# EAGLE design DIP-VGA-v1.0 (EAGLE 7.5.0)
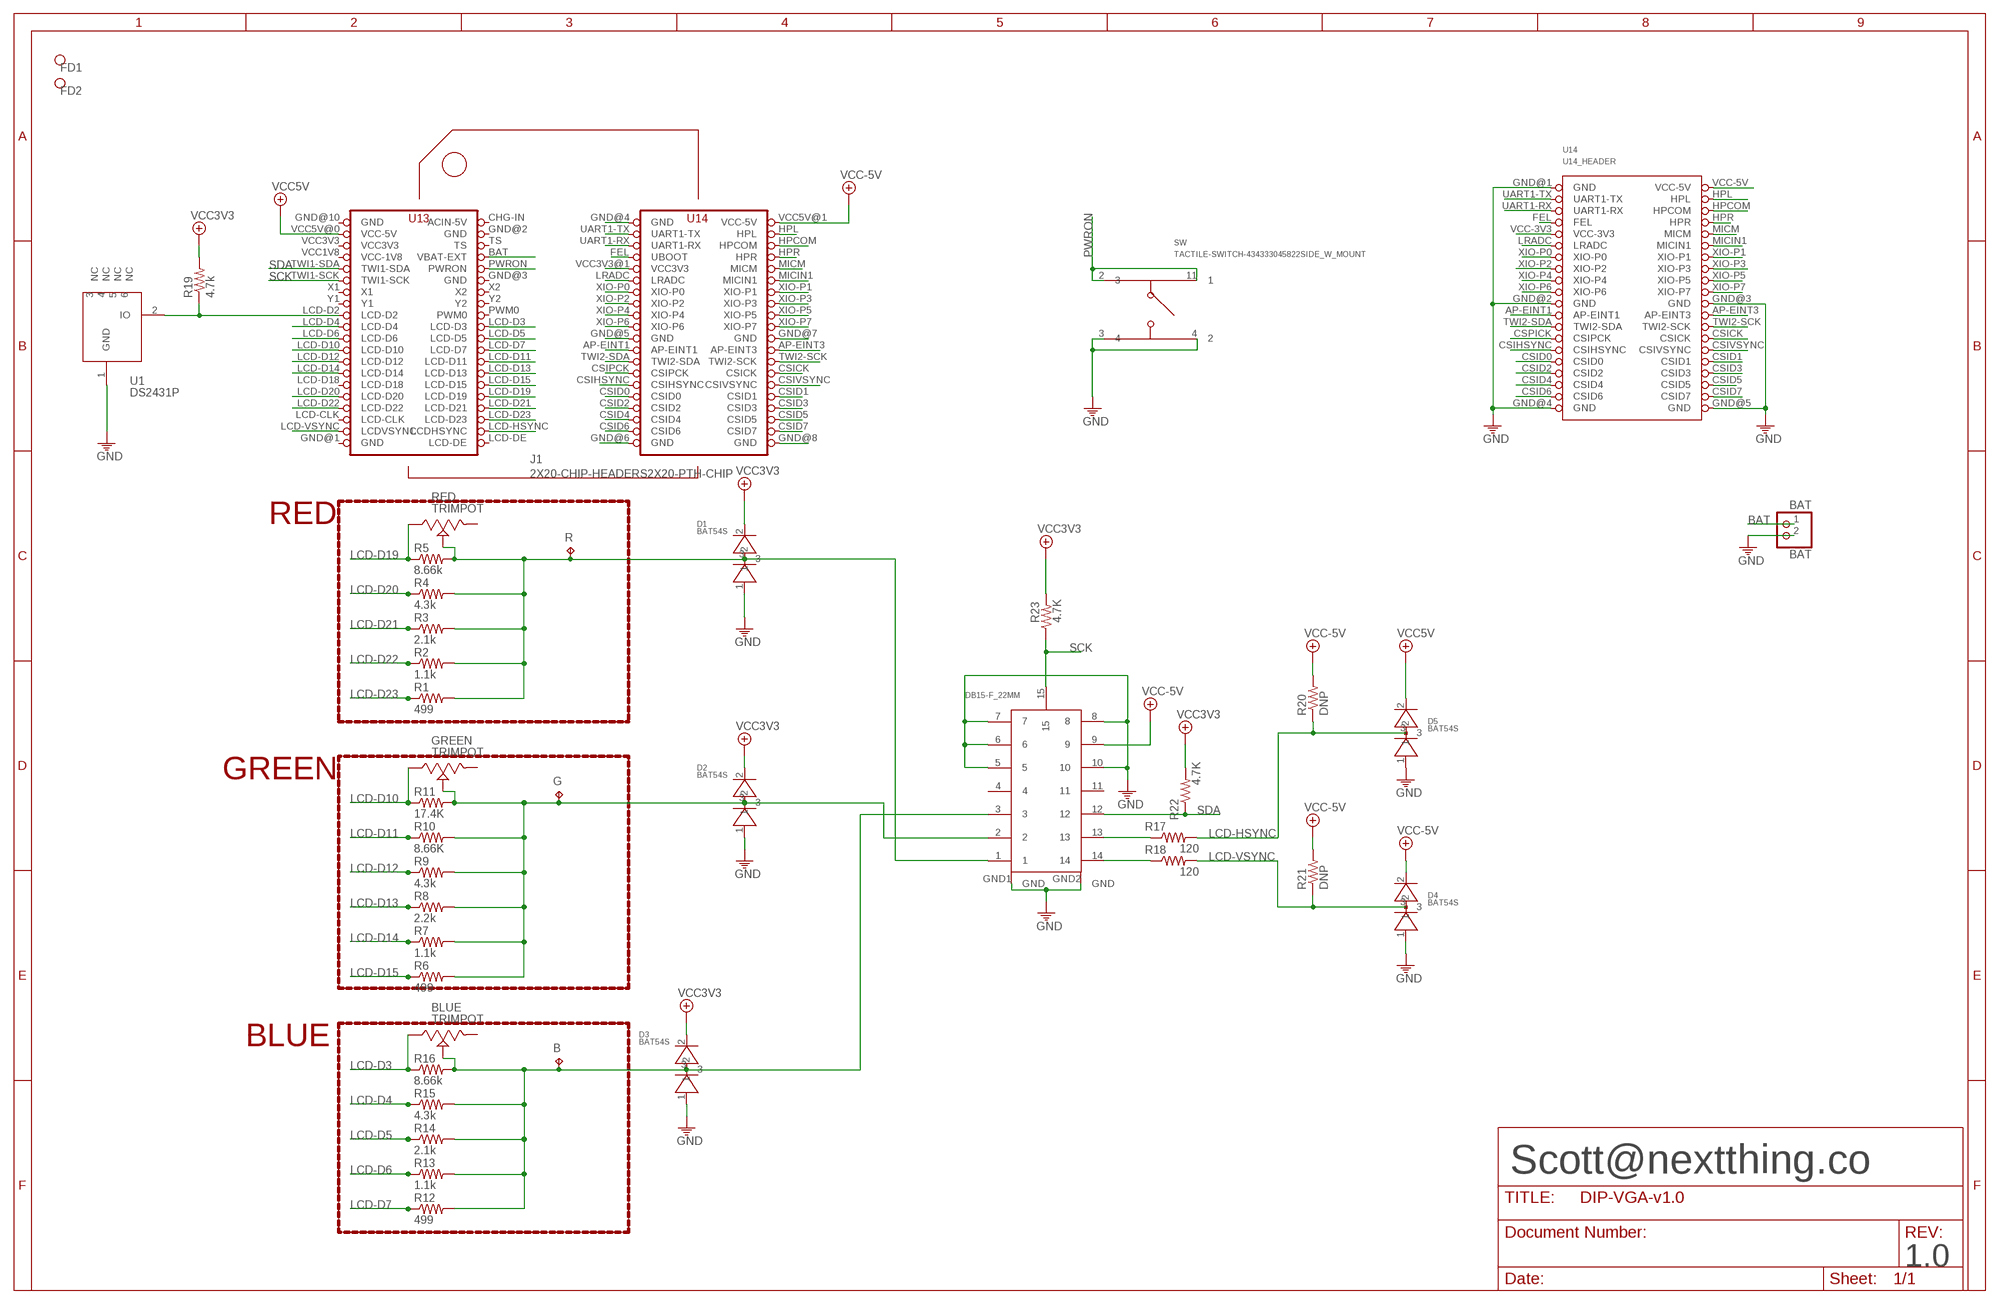
[diagram p0: schematic, sheet 1]

## Parts
B  TPPAD1-17  [P1-17]
BAT  BAT  JST_2PIN-THM-RA  [JST-PH-2-THM-RA]
BLUE  TRIMPOT  [TRIMPOT]
D1  BAT54S  [SOT23-BEC]
D2  BAT54S  [SOT23-BEC]
D3  BAT54S  [SOT23-BEC]
D4  BAT54S  [SOT23-BEC]
D5  BAT54S  [SOT23-BEC]
FD1  FIDUCIAL  [FIDUCIAL_1MM]
FD2  FIDUCIAL  [FIDUCIAL_1MM]
G  TPPAD1-17  [P1-17]
GREEN  TRIMPOT  [TRIMPOT]
J1  2X20-CHIP-HEADERS2X20-PTH-CHIP  [2X20CHIP-TH]
R  TPPAD1-17  [P1-17]
R1  499  RESISTOR  [R0603_5MIL_DWS]
R2  1.1k  RESISTOR  [R0603_5MIL_DWS]
R3  2.1k  RESISTOR  [R0603_5MIL_DWS]
R4  4.3k  RESISTOR  [R0603_5MIL_DWS]
R5  8.66k  RESISTOR  [R0603_5MIL_DWS]
R6  499  RESISTOR  [R0603_5MIL_DWS]
R7  1.1k  RESISTOR  [R0603_5MIL_DWS]
R8  2.2k  RESISTOR  [R0603_5MIL_DWS]
R9  4.3k  RESISTOR  [R0603_5MIL_DWS]
R10  8.66K  RESISTOR  [R0603_5MIL_DWS]
R11  17.4K  RESISTOR  [R0603_5MIL_DWS]
R12  499  RESISTOR  [R0603_5MIL_DWS]
R13  1.1k  RESISTOR  [R0603_5MIL_DWS]
R14  2.1k  RESISTOR  [R0603_5MIL_DWS]
R15  4.3k  RESISTOR  [R0603_5MIL_DWS]
R16  8.66k  RESISTOR  [R0603_5MIL_DWS]
R17  120  RESISTOR  [R0603_5MIL_DWS]
R18  120  RESISTOR  [R0603_5MIL_DWS]
R19  4.7k  RESISTOR  [R0603_5MIL_DWS]
R20  DNP  RESISTOR  [R0603_5MIL_DWS]
R21  DNP  RESISTOR  [R0603_5MIL_DWS]
R22  4.7K  RESISTOR  [R0603_5MIL_DWS]
R23  4.7K  RESISTOR  [R0603_5MIL_DWS]
RED  TRIMPOT  [TRIMPOT]
SW  TACTILE-SWITCH-434333045822SIDE_W_MOUNT  [TACTILE-SWITCH-K2-1114UA-AW]
TRANS(>^_^)>  DB15-F_22MM  [DB15-F_22MM]
U1  DS2431P  [TSOC6]
U14  U14_HEADER  [U14HEADER]

## Nets
1: J1.CSIVSYNC U14.CSIVSYNC
AP-EINT1: J1.AP-EINT1 U14.AP-EINT1
AP-EINT3: J1.AP-EINT3 U14.AP-EINT3
BAT: BAT.1 J1.BAT(VBAT-EXT)
CSICK: J1.CSICK U14.CSICK
CSID0: J1.CSID0 U14.CSID0
CSID1: J1.CSID1 U14.CSID1
CSID2: J1.CSID2 U14.CSID2
CSID3: J1.CSID3 U14.CSID3
CSID4: J1.CSID4 U14.CSID4
CSID5: J1.CSID5 U14.CSID5
CSID6: J1.CSID6 U14.CSID6
CSID7: J1.CSID7 U14.CSID7
CSIHSYNC: J1.CSIHSYNC U14.CSIHSYNC
CSPICK: J1.CSIPCK U14.CSPICK(CSIPCK)
FEL: J1.FEL(UBOOT) U14.FEL
GND: BAT.2 D1.1 D2.1 D3.1 D4.1 D5.1 J1.GND@4(GND) J1.GND@5(GND) J1.GND@6(GND) J1.GND@7(GND) J1.GND@8(GND) SW.3 SW.4 TRANS(>^_^)>.5 TRANS(>^_^)>.6 TRANS(>^_^)>.7 TRANS(>^_^)>.8 TRANS(>^_^)>.10 TRANS(>^_^)>.GND1(GND) TRANS(>^_^)>.GND2(GND) U1.1(GND) U14.GND@1(GND) U14.GND@2(GND) U14.GND@3(GND) U14.GND@4(GND) U14.GND@5(GND)
HPCOM: J1.HPCOM U14.HPCOM
HPL: J1.HPL U14.HPL
HPR: J1.HPR U14.HPR
LCD-D3: BLUE.3 J1.LCD-D3 R16.1
LCD-D4: J1.LCD-D4 R15.1
LCD-D5: J1.LCD-D5 R14.1
LCD-D6: J1.LCD-D6 R13.1
LCD-D7: J1.LCD-D7 R12.1
LCD-D10: GREEN.3 J1.LCD-D10 R11.1
LCD-D11: J1.LCD-D11 R10.1
LCD-D12: J1.LCD-D12 R9.1
LCD-D13: J1.LCD-D13 R8.1
LCD-D14: J1.LCD-D14 R7.1
LCD-D15: J1.LCD-D15 R6.1
LCD-D19: J1.LCD-D19 R5.1 RED.3
LCD-D20: J1.LCD-D20 R4.1
LCD-D21: J1.LCD-D21 R3.1
LCD-D22: J1.LCD-D22 R2.1
LCD-D23: J1.LCD-D23 R1.1
LCD-HSYNC: D5.3 J1.LCD-HSYNC(LCDHSYNC) R17.2 R20.1
LCD-VSYNC: D4.3 J1.LCD-VSYNC(LCDVSYNC) R18.2 R21.1
LRADC: J1.LRADC U14.LRADC
MICIN1: J1.MICIN1 U14.MICIN1
MICM: J1.MICM U14.MICM
N$1: R17.1 TRANS(>^_^)>.13
N$2: R18.1 TRANS(>^_^)>.14
N$5: J1.LCD-D2 R19.1 U1.2(IO)
N$12: D2.3 G.TP GREEN.2 R6.2 R7.2 R8.2 R9.2 R10.2 R11.2 TRANS(>^_^)>.2
N$13: D1.3 R1.2 R2.2 R3.2 R4.2 R5.2 R.TP RED.2 TRANS(>^_^)>.1
N$19: B.TP BLUE.2 D3.3 R12.2 R13.2 R14.2 R15.2 R16.2 TRANS(>^_^)>.3
PWRON: J1.PWRON SW.2 SW.11
SCK: J1.TWI1-SCK R23.1 TRANS(>^_^)>.15
SDA: J1.TWI1-SDA R22.1 TRANS(>^_^)>.12
TWI2-SCK: J1.TWI2-SCK U14.TWI2-SCK
TWI2-SDA: J1.TWI2-SDA U14.TWI2-SDA
UART1-RX: J1.UART1-RX U14.UART1-RX
UART1-TX: J1.UART1-TX U14.UART1-TX
VCC3V3: D1.2 D2.2 D3.2 J1.VCC3V3@1(VCC3V3) R19.2 R22.2 R23.2 U14.VCC-3V3
VCC5V: D4.2 D5.2 J1.VCC5V@0(VCC-5V) J1.VCC5V@1(VCC-5V) R20.2 R21.2 TRANS(>^_^)>.9 U14.VCC-5V ; supply symbol labelled VCC-5V
XIO-P0: J1.XIO-P0 U14.XIO-P0
XIO-P1: J1.XIO-P1 U14.XIO-P1
XIO-P2: J1.XIO-P2 U14.XIO-P2
XIO-P3: J1.XIO-P3 U14.XIO-P3
XIO-P4: J1.XIO-P4 U14.XIO-P4
XIO-P5: J1.XIO-P5 U14.XIO-P5
XIO-P6: J1.XIO-P6 U14.XIO-P6
XIO-P7: J1.XIO-P7 U14.XIO-P7
Unconnected: BLUE.1 GREEN.1 J1.CHG-IN(ACIN-5V) J1.LCD-CLK J1.LCD-D18 J1.LCD-DE J1.PWM0 J1.TS J1.X1 J1.X2 J1.Y1 J1.Y2 RED.1 TRANS(>^_^)>.4 TRANS(>^_^)>.11 U1.3(NC) U1.4(NC) U1.5(NC) U1.6(NC)

## Notes on the sheet
- RED
- GREEN
- BLUE
- Scott@nextthing.co
- 1.0

## Power pins joined to a net without a drawn wire
GND: J1.GND@1(GND) J1.GND@2(GND) J1.GND@3(GND) J1.GND@10(GND)
VCC3V3: J1.VCC3V3
VCC-1V8: J1.VCC1V8(VCC-1V8)

## Library data of the parts
B G R = testpad:TP: Test pad
BAT = VGA-DIP:JST_2PIN: JST 2-Pin Connectors of various flavors SMT-RA (S2B-PH-SM4) 4UConnector #17311 SMT (B2B-PH-SM4) THM-RA (S2B-PH) THM (B2B-PH)
BLUE GREEN RED = VGA-DIP:TRIMPOT
D1-D5 = VGA-DIP:BAT54S
FD1 FD2 = VGA-DIP:FIDUCIAL; ASSEMBLE: N.C; DESCRIPTION: Fiducial; PART_NUMBER: RB00000042
J1 = VGA-DIP:2X20-CHIP-HEADERS: Through hole layout with chip reference; DESCRIPTION: 2x20 .100" headers; FOOTPRINT: 2x20 .100" CHIP foot print; VENDOR: ASSMANN; VENDOR_PART_NUMBER: AWHW40-G-SMD-R (single)
R1-R23 = VGA-DIP:RESISTOR
SW = cheeper:TACTILE-SWITCH-434333045822
TRANS(>^_^)> = VGA-DIP:DB15-F_22MM
U1 = VGA-DIP:DS2431: 1024-Bit EEPROM This chip provides a 4x256 Bit EEPROM, which can be programmed@5V. Write protection and OTP emulation are available, too. Author: Jan Kandziora <jjj@gmx.de>; DESCRIPTION: IC, 1024-Bit, 1-Wire EEPROM, TSOC6; FOOTPRINT: TSOC6; LINK: http://www.digikey.com/product-detail/en/DS2431P%2BT%26R/DS2431P%2BT%26RCT-ND/3647900; MFG: DIGIKEY; MFG_PN: DS2431P+T&RCT-ND; PART_TYPE: IC; PRICE: 0.98; VENDOR: MAXIM; VENDOR_PART_NUMBER: DS2431P+T&R
U14 = VGA-DIP:U14_HEADER

## Board
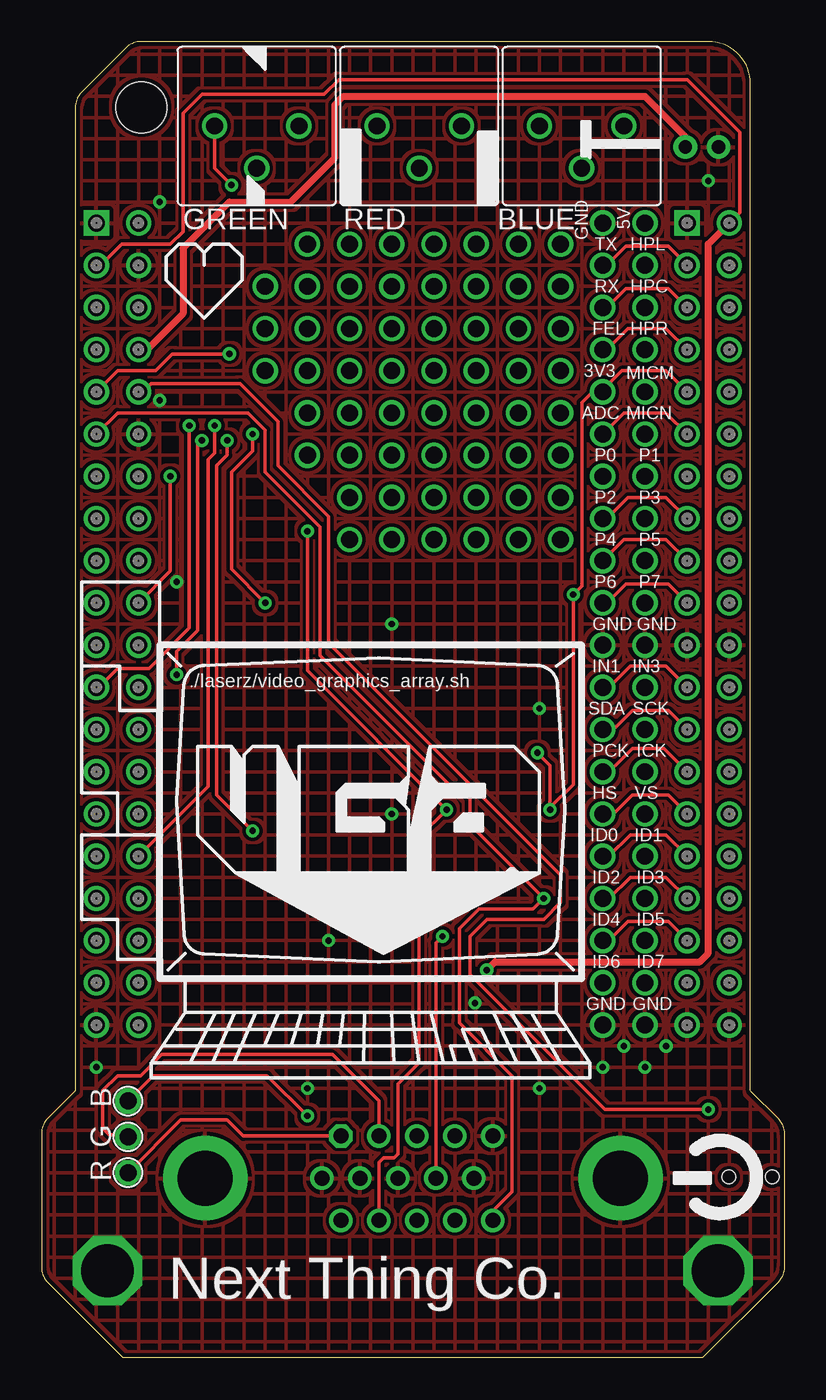
[diagram p1: board, top side]
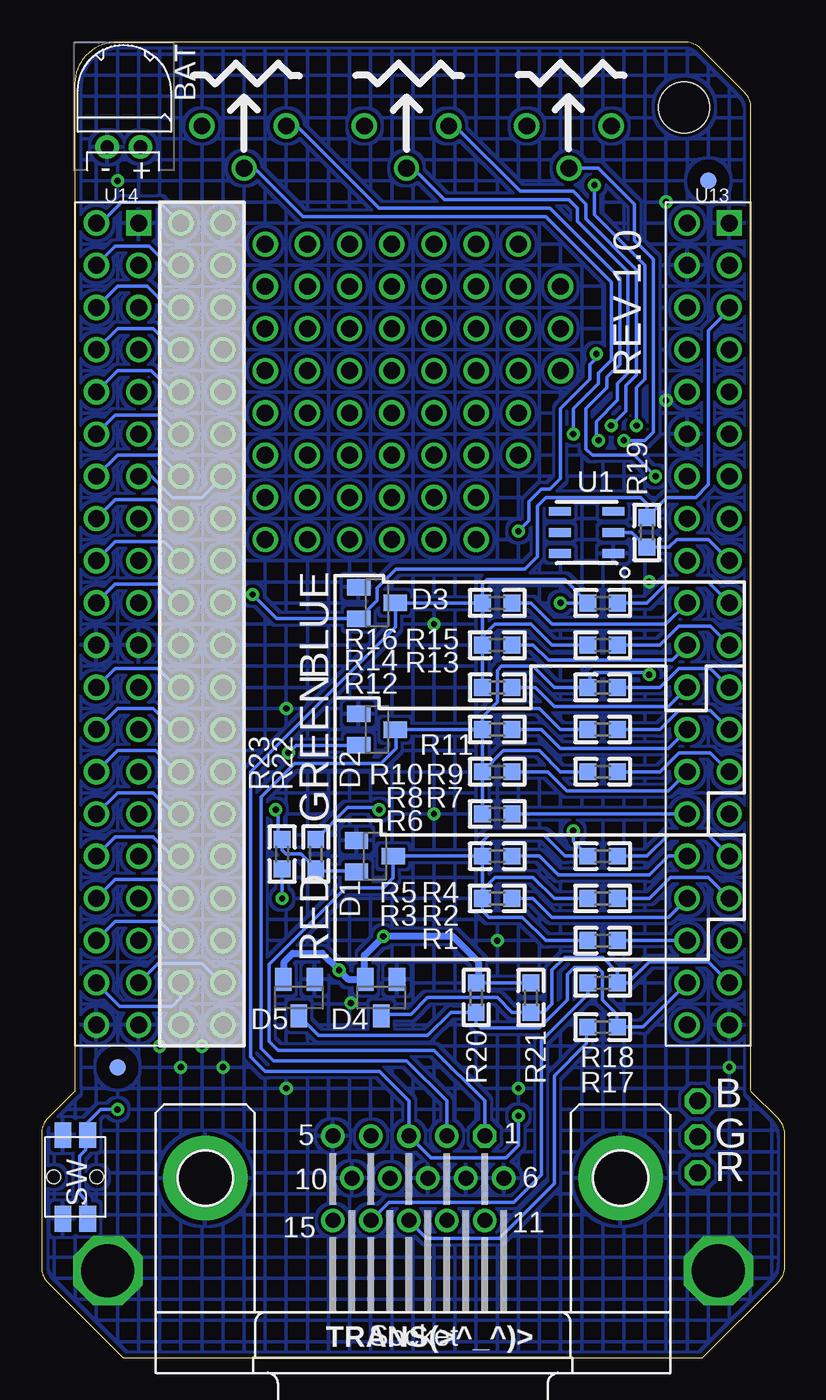
[diagram p2: board, bottom side, seen from below]

Size 44.7 x 79.22 mm. Coordinates in mm from the lower left corner, seen from the top.
Outline: 2.03,16.1 2.03,75.26 arc-45 2.4,76.16 5.09,78.84 arc-45 5.99,79.22 40.13,79.22 arc-90 42.67,76.68 42.67,16.1
Outline: 2.03,16.07 0.37,14.41 arc45 0,13.51 0,5.45 arc45 0.37,4.55 4.92,0 39.78,0 44.33,4.55 arc45 44.7,5.45 44.7,13.51 arc45 44.33,14.41 42.67,16.07
Copper layers (1*2*15*16): Top 0.035mm / dielectric 0.2mm / Route2 0.035mm / dielectric 0.2mm / Route15 0.035mm / dielectric 0.2mm / Bottom 0.035mm
Design rules "Hampoo *": minimum track width 3mil, minimum drill 8mil, track to track 3mil, track to pad 3mil, pad to pad 3mil, via to via 3mil, smd to smd 3mil, copper to edge 10mil, drill to drill 8mil, minimum pad ring 10mil, minimum via ring 8mil, stop-mask expansion 4mil, vias tented up to drill 39mil, thermal gap 10mil
Holes 3.05 mm at 6.02,75.25

### Footprints (pad centres in the part's own frame; a part is rotated, then mirrored left to right if it is on the bottom)
P1-17 = drill 1.016 pad 1.524 octagon: TP 0,0
JST-PH-2-THM-RA = drill 0.8 pad 1.422: 1 1,0; 2 -1,0
TRIMPOT = drill 1.016: 1 2.54,0; 2 0,-2.54; 3 -2.54,0
SOT23-BEC = smd 1 x 1.4: 1 -0.95,-1.1; 2 0.95,-1.1; 3 0,1.1
FIDUCIAL_1MM = smd 1 x 1: 1 0,0
2X20CHIP-TH = drill 1.016: AP-EINT1 36.83,21.59; AP-EINT3 39.37,21.59; BAT 3.81,41.91; CHG-IN 3.81,49.53; CSICK 39.37,16.51; CSID0 36.83,11.43; CSID1 39.37,11.43; CSID2 36.83,8.89; CSID3 39.37,8.89; CSID4 36.83,6.35; CSID5 39.37,6.35; CSID6 36.83,3.81; CSID7 39.37,3.81; CSIHSYNC 36.83,13.97; CSIPCK 36.83,16.51; CSIVSYNC 39.37,13.97; FEL 36.83,41.91; GND@1 3.81,36.83; GND@2 1.27,1.27; GND@4 39.37,24.13; GND@5 39.37,1.27; GND@6 36.83,1.27; GND@7 36.83,24.13; GND@10 3.81,46.99; HPCOM 39.37,44.45; HPL 39.37,46.99; HPR 39.37,41.91; LCD-CLK 1.27,6.35; LCD-D2 1.27,29.21; LCD-D3 3.81,26.67; LCD-D4 1.27,26.67; LCD-D5 3.81,24.13; LCD-D6 1.27,24.13; LCD-D7 3.81,21.59; LCD-D10 1.27,21.59; LCD-D11 3.81,19.05; LCD-D12 1.27,19.05; LCD-D13 3.81,16.51; LCD-D14 1.27,16.51; LCD-D15 3.81,13.97; LCD-D18 1.27,13.97; LCD-D19 3.81,11.43; LCD-D20 1.27,11.43; LCD-D21 3.81,8.89; LCD-D22 1.27,8.89; LCD-D23 3.81,6.35; LCD-DE 3.81,1.27; LCD-HSYNC 3.81,3.81; LCD-VSYNC 1.27,3.81; LRADC 36.83,36.83; MICIN1 39.37,36.83; MICM 39.37,39.37; PWM0 3.81,29.21; PWRON 3.81,39.37; TS 3.81,44.45; TWI1-SCK 1.27,36.83; TWI1-SDA 1.27,39.37; TWI2-SCK 39.37,19.05; TWI2-SDA 36.83,19.05; UART1-RX 36.83,44.45; UART1-TX 36.83,46.99; VCC1V8 1.27,41.91; VCC3V3 1.27,44.45; VCC3V3@1 36.83,39.37; VCC5V@0 1.27,46.99; VCC5V@1 39.37,49.53; X1 1.27,34.29; X2 3.81,34.29; XIO-P0 36.83,34.29; XIO-P1 39.37,34.29; XIO-P2 36.83,31.75; XIO-P3 39.37,31.75; XIO-P4 36.83,29.21; XIO-P5 39.37,29.21; XIO-P6 36.83,26.67; XIO-P7 39.37,26.67; Y1 1.27,31.75; Y2 3.81,31.75 | drill 1.016 square: GND@3 1.27,49.53; GND@8 36.83,49.53
R0603_5MIL_DWS = smd 1.016 x 1.016: 1 -0.889,0; 2 0.889,0
TACTILE-SWITCH-K2-1114UA-AW = smd 1.55 x 1: 2 -2.525,0.75; 3 -2.525,-0.75; 4 2.525,-0.75; 11 2.525,0.75 | hole 0.8: 0,1.3; 0,-1.3
DB15-F_22MM = drill 0.9 octagon: 1 4.329,6.35 | drill 0.9: 2 2.043,6.35; 3 -0.243,6.35; 4 -2.529,6.35; 5 -4.815,6.35; 6 5.472,3.81; 7 3.186,3.81; 8 0.9,3.81; 9 -1.386,3.81; 10 -3.672,3.81; 11 4.329,1.27; 12 2.043,1.27; 13 -0.243,1.27; 14 -2.529,1.27; 15 -4.815,1.27 | drill 3.302 pad 5.08: GND1 -12.497,3.81; GND2 12.497,3.81
TSOC6 = smd 0.53 x 1.33: 1 -1.27,-1.6; 2 0,-1.6; 3 1.27,-1.6; 4 1.27,1.6; 5 0,1.6; 6 -1.27,1.6
U14HEADER = drill 1.016: AP-EINT1 -1.27,-16.51; AP-EINT3 1.27,-16.51; CSICK 1.27,-21.59; CSID0 -1.27,-26.67; CSID1 1.27,-26.67; CSID2 -1.27,-29.21; CSID3 1.27,-29.21; CSID4 -1.27,-31.75; CSID5 1.27,-31.75; CSID6 -1.27,-34.29; CSID7 1.27,-34.29; CSIHSYNC -1.27,-24.13; CSIVSYNC 1.27,-24.13; CSPICK -1.27,-21.59; FEL -1.27,3.81; GND@1 -1.27,11.43; GND@2 -1.27,-13.97; GND@3 1.27,-13.97; GND@4 -1.27,-36.83; GND@5 1.27,-36.83; HPCOM 1.27,6.35; HPL 1.27,8.89; HPR 1.27,3.81; LRADC -1.27,-1.27; MICIN1 1.27,-1.27; MICM 1.27,1.27; TWI2-SCK 1.27,-19.05; TWI2-SDA -1.27,-19.05; UART1-RX -1.27,6.35; UART1-TX -1.27,8.89; VCC-3V3 -1.27,1.27; VCC-5V 1.27,11.43; XIO-P0 -1.27,-3.81; XIO-P1 1.27,-3.81; XIO-P2 -1.27,-6.35; XIO-P3 1.27,-6.35; XIO-P4 -1.27,-8.89; XIO-P5 1.27,-8.89; XIO-P6 -1.27,-11.43; XIO-P7 1.27,-11.43

### Placement (x,y rotation side)
B  5.21,15.46 0 top
BAT  39.75,72.87 0 bottom
BLUE  32.51,74.14 0 top
D1  24.64,30.19 270 bottom
D2  24.51,37.81 270 bottom
D3  24.51,45.43 270 bottom
D4  24.26,21.69 180 bottom
D5  29.21,21.69 180 bottom
FD1  40.13,17.49 0 bottom
FD2  4.57,70.83 0 bottom
G  5.21,13.3 0 top
GREEN  12.95,74.14 0 top
J1  2.03,18.76 0 top
R  5.21,11.14 0 top
R1  10.92,25.11 180 bottom
R2  10.92,27.65 180 bottom
R3  17.27,27.65 180 bottom
R4  10.92,30.19 180 bottom
R5  17.27,30.19 180 bottom
R6  17.27,32.73 180 bottom
R7  10.92,35.27 180 bottom
R8  17.27,35.27 180 bottom
R9  10.92,37.81 180 bottom
R10  17.27,37.81 180 bottom
R11  10.92,40.35 180 bottom
R12  17.27,40.35 180 bottom
R13  10.92,42.89 180 bottom
R14  17.27,42.89 180 bottom
R15  10.92,45.43 180 bottom
R16  17.27,45.43 180 bottom
R17  10.92,19.91 0 bottom
R18  10.92,22.57 0 bottom
R19  8.27,49.67 90 bottom
R20  18.54,21.69 90 bottom
R21  15.24,21.69 90 bottom
R22  28.19,30.32 270 bottom
R23  30.23,30.32 90 bottom
RED  22.73,74.14 0 top
SW  42.67,10.89 270 bottom
TRANS(>^_^)>  22.35,7 0 bottom
U1  11.89,49.67 90 bottom
U14  35.05,56.86 0 top

### Tracks (layer width: path | path; a pad name or v marks a point on that pad's centre or on a via)
1
  Bottom 0.203: J1.CSIVSYNC 40.13,34 37.97,34 36.7,32.73 U14.CSIVSYNC
AP-EINT1
  Top 0.203: J1.AP-EINT1 37.59,41.62 35.43,41.62 34.16,40.35 U14.AP-EINT1
AP-EINT3
  Bottom 0.203: J1.AP-EINT3 40.26,41.5 37.72,41.5 36.58,40.35 U14.AP-EINT3
BAT
  Top 0.406: J1.BAT 6.35,60.67 8.51,62.83 8.51,66.77 11.3,69.56 14.99,69.56 17.65,72.23 17.65,75.41 18.16,75.91 36.32,75.91 38.75,73.49 BAT.1
CSICK
  Bottom 0.203: J1.CSICK 40.13,36.54 37.85,36.54 36.58,35.27 U14.CSICK
CSID0
  Top 0.203: J1.CSID0 37.59,31.46 35.43,31.46 34.16,30.19 U14.CSID0
CSID1
  Bottom 0.203: J1.CSID1 40.26,31.34 37.97,31.34 36.83,30.19 U14.CSID1
CSID2
  Top 0.203: J1.CSID2 37.59,28.92 35.43,28.92 34.16,27.65 U14.CSID2
CSID3
  Bottom 0.203: J1.CSID3 40.26,28.8 37.72,28.8 36.58,27.65 U14.CSID3
CSID4
  Top 0.203: J1.CSID4 37.72,26.26 35.31,26.26 34.16,25.11 U14.CSID4
CSID5
  Bottom 0.203: J1.CSID5 40.26,26.26 37.59,26.26 36.45,25.11 U14.CSID5
CSID6
  Bottom 0.203: J1.CSID6 37.69,23.75 35.08,23.75 33.91,22.57 U14.CSID6
CSID7
  Bottom 0.203: J1.CSID7 40,21.17 36.84,21.17 36.32,21.69 U14.CSID7
CSIHSYNC
  Top 0.203: J1.CSIHSYNC 37.72,33.88 35.56,33.88 34.42,32.73 U14.CSIHSYNC
CSPICK
  Top 0.203: J1.CSIPCK 37.47,36.67 35.56,36.67 34.16,35.27 U14.CSPICK
FEL
  Top 0.203: J1.FEL 37.59,61.94 35.31,61.94 34.04,60.67 U14.FEL
GND  (via drill 0.38, 3.17)
  other vias: 17.27,25.11 26.09,21.36 21.08,32.73 7.11,69.56 3.3,17.49 35.05,18.76 3.96,5.25 40.72,5.25 8.13,46.7 29.97,39.08 36.32,17.49 33.78,17.49 37.59,18.76 29.97,16.22 16,16.22 7.11,57.63 21.08,44.16 40.13,70.83
  pour Bottom (isolate 0.203, hatched): 2.03,16.1 2.03,74.74 arc-45 2.78,76.53 4.72,78.47 arc-45 6.51,79.22 40.13,79.22 arc-90 42.67,76.68 42.67,16.1 43.96,14.81 arc-45 44.7,13.01 44.7,4.92 39.79,0.01 4.91,0.01 0,4.92 0,13.01 arc-45 0.74,14.81
  pour Top (isolate 0.203, hatched): 2.03,16.1 2.03,74.74 arc-45 2.78,76.53 4.72,78.47 arc-45 6.51,79.22 40.13,79.22 arc-90 42.67,76.68 42.67,16.1 43.96,14.81 arc-45 44.7,13.01 44.7,4.92 39.78,-0.01 4.93,-0.01 0,4.92 0,13.01 arc-45 0.74,14.81
HPCOM
  Bottom 0.203: J1.HPCOM 40.13,64.48 38.35,64.48 37.08,63.21 U14.HPCOM
HPL
  Bottom 0.203: J1.HPL 40.26,66.9 38.23,66.9 37.08,65.75 U14.HPL
HPR
  Bottom 0.203: J1.HPR 40.13,61.94 37.97,61.94 36.7,60.67 U14.HPR
LCD-D3  (via drill 0.38)
  Top 0.203: v7.75,53.05 7.75,47.34 J1.LCD-D3
  Bottom 0.203: J1.LCD-D3 7.11,44.16 13.97,44.16 15.24,45.43 R16.1 | v7.75,53.05 9.02,54.32 11.56,54.32 11.94,54.71 11.94,57.12 10.67,58.39 10.67,59.02 9.91,59.79 9.91,64.99 14.1,69.18 24.38,69.18 29.34,74.14 BLUE.3
LCD-D4
  Bottom 0.203: J1.LCD-D4 4.56,46.7 6.99,46.7 8.25,45.43 R15.1
LCD-D5
  Bottom 0.203: J1.LCD-D5 6.75,41.99 14.21,41.99 15.11,42.89 R14.1
LCD-D6
  Bottom 0.203: J1.LCD-D6 4.45,44.04 6.35,44.04 7.49,42.89 R13.1
LCD-D7
  Bottom 0.203: J1.LCD-D7 6.99,39.21 13.84,39.21 14.99,40.35 R12.1
LCD-D10  (via drill 0.38)
  Top 0.203: J1.LCD-D10 3.43,40.35 4.57,41.5 6.48,41.5 8.89,43.91 v8.89,56.1 | v11.43,70.58 10.41,71.6 GREEN.3
  Bottom 0.203: J1.LCD-D10 4.45,41.5 6.35,41.5 7.49,40.35 R11.1 | v8.89,56.1 8.89,58.39 8.38,58.9 8.38,65.75 11.43,68.8 v11.43,70.58
LCD-D11
  Bottom 0.203: J1.LCD-D11 6.99,36.67 13.46,36.67 14.61,37.81 R10.1
LCD-D12
  Bottom 0.203: J1.LCD-D12 4.45,38.96 6.35,38.96 7.49,37.81 R9.1
LCD-D13
  Bottom 0.203: J1.LCD-D13 6.99,34.13 13.08,34.13 14.22,35.27 R8.1
LCD-D14
  Bottom 0.203: J1.LCD-D14 4.45,36.42 6.35,36.42 7.49,35.27 R7.1
LCD-D15
  Bottom 0.203: J1.LCD-D15 R6.1
LCD-D19  (via drill 0.38)
  Top 0.203: J1.LCD-D19 10.03,34.39 10.03,54.07 10.41,54.45 v10.41,56.1
  Bottom 0.203: J1.LCD-D19 6.99,30.19 8.13,29.05 13.59,29.05 14.73,30.19 R5.1 | v10.41,56.1 9.53,56.99 9.53,58.52 8.89,59.15 8.89,65.5 11.94,68.55 11.94,69.44 12.7,70.2 15.88,70.2 19.81,74.14 RED.3
LCD-D20
  Bottom 0.203: J1.LCD-D20 4.57,31.46 6.99,31.46 8.25,30.19 R4.1
LCD-D21
  Bottom 0.203: J1.LCD-D21 6.99,26.51 13.97,26.51 15.11,27.65 R3.1
LCD-D22
  Bottom 0.203: J1.LCD-D22 4.57,28.92 6.86,28.92 8.13,27.65 R2.1
LCD-D23
  Bottom 0.203: J1.LCD-D23 R1.1
LCD-HSYNC
  Bottom 0.203: J1.LCD-HSYNC 8.51,19.91 R17.2 10.08,19.96 10.08,20.67 10.95,21.53 10.95,23.21 11.25,23.51 12.62,23.51 13.06,23.08 13.06,21.53 14.73,19.86 18.26,19.86 18.54,20.14 R20.1 20.07,20.8 21.46,19.4 28.02,19.4 D5.3
LCD-VSYNC
  Bottom 0.203: J1.LCD-VSYNC 4.57,23.84 8.13,23.84 9.4,22.57 R18.2 10.03,23.21 10.91,24.09 13.21,24.09 13.97,23.34 13.97,21.3 14.48,20.8 14.99,20.8 15.11,20.67 R21.1 16.38,20.8 17.27,21.69 21.46,21.69 22.48,20.67 24.17,20.67 D4.3
LRADC
  Top 0.203: J1.LRADC 37.59,56.86 35.05,56.86 U14.LRADC
MICIN1
  Bottom 0.203: J1.MICIN1 40.26,56.74 37.59,56.74 36.45,55.59 U14.MICIN1
MICM
  Bottom 0.203: J1.MICM 40.13,59.4 38.1,59.4 36.83,58.13 U14.MICM
N$1
  Bottom 0.203: R17.1 11.91,19.81 11.91,18.92 13.84,16.99 13.84,10.51 17.14,7.21 21.53,7.21 TRANS(>^_^)>.13
N$2
  Bottom 0.203: R18.1 11.81,21.86 14.61,19.07 14.61,11.02 16.26,9.37 23.79,9.37 TRANS(>^_^)>.14
N$4  (via drill 1.02)
  other vias: 18.54,67.02
N$5
  Bottom 0.203: J1.LCD-D2 4.57,49.24 6.48,49.24 6.94,48.79 R19.1 9.16,49.67 U1.2
N$6  (via drill 1.02)
  other vias: 16,67.02
N$7  (via drill 1.02)
  other vias: 16,64.48
N$8  (via drill 1.02)
  other vias: 13.46,64.48
N$9  (via drill 1.02)
  other vias: 13.46,61.94
N$10  (via drill 1.02)
  other vias: 31.24,59.4
N$11  (via drill 1.02)
  other vias: 31.24,61.94
N$12  (via drill 0.38)
  Top 0.203: G.TP 5.08,13.43 4.06,13.43 3.68,13.81 3.68,16.1 4.57,16.99 5.97,16.99 7.24,18.26 17.52,18.26 20.31,15.46 TRANS(>^_^)>.2 | v8.13,41.12 8.13,42.51 9.4,43.78 9.4,54.96 v9.65,55.21
  Bottom 0.203: 17.65,39.08 17.27,39.47 17.27,41.37 17.02,41.62 15.11,41.62 13.84,40.35 R11.2 11.68,40.48 11.68,40.99 11.43,41.24 8.25,41.24 v8.13,41.12 | R10.2 18.16,38.58 17.65,39.08 | R9.2 13.46,37.81 14.73,39.08 17.65,39.08 | R10.2 R8.2 | R8.2 R6.2 | R7.2 13.46,35.27 14.73,36.54 16.89,36.54 R8.2 | R10.2 D2.3 23.37,37.77 23.37,36.67 24.26,35.78 29.46,35.78 31.5,33.75 31.5,18.64 30.73,17.88 22.72,17.88 20.31,15.46 TRANS(>^_^)>.2 | v9.65,55.21 8.38,55.21 7.87,55.72 7.87,66.14 9.02,67.28 9.02,69.44 11.18,71.6 GREEN.2
N$13  (via drill 0.38)
  Top 0.203: v12.7,31.72 10.54,33.88 10.54,53.69 11.18,54.32 v11.18,55.21 | TRANS(>^_^)>.1 12.14,13.35 11.18,14.32 8.38,14.32 R.TP
  Bottom 0.203: R5.2 18.16,31.08 17.78,31.46 14.48,31.46 13.21,30.19 R4.2 12.7,31.08 v12.7,31.72 | R5.2 18.16,28.16 | 18.16,28.16 R3.2 18.16,26.89 17.78,26.51 15.75,26.51 14.35,25.11 R1.2 | R2.2 13.84,27.65 15.11,28.92 17.4,28.92 18.16,28.16 | R5.2 D1.3 23.54,28.88 24.13,28.29 26.42,28.29 31.01,23.69 31.01,19.04 30.48,18.51 21.07,18.51 18.02,15.46 TRANS(>^_^)>.1 | v11.18,55.21 11.3,55.34 11.3,56.36 10.03,57.63 10.03,58.64 9.4,59.28 9.4,65.37 12.45,68.42 12.45,69.18 12.95,69.69 20.45,69.69 22.35,71.6 RED.2
N$14  (via drill 1.02)
  other vias: 31.24,64.48
N$15  (via drill 1.02)
  other vias: 31.24,67.02
N$16  (via drill 1.02)
  other vias: 28.7,67.02
N$17  (via drill 1.02)
  other vias: 28.7,64.48
N$18  (via drill 1.02)
  other vias: 28.7,61.94
N$19  (via drill 0.38)
  Top 0.203: B.TP 6.73,16.99 13.59,16.99 v16,14.57 | v12.7,55.59 12.7,54.58 11.43,53.31 11.43,47.47 v13.46,45.43
  Bottom 0.203: R16.2 18.16,46.58 17.91,46.83 13.21,46.83 R15.2 v13.46,45.43 | R16.2 18.16,43.4 | 18.16,43.4 R14.2 R12.2 | R13.2 13.97,42.89 15.24,44.16 17.4,44.16 18.16,43.4 | R16.2 D3.3 23.41,43.99 32.13,35.27 32.13,18.13 31.24,17.24 24.37,17.24 22.59,15.46 TRANS(>^_^)>.3 21.27,12.03 16.76,12.03 16,12.8 v16,14.57 | v12.7,55.59 12.7,57.12 11.18,58.64 11.18,59.28 10.41,60.04 10.41,64.74 14.35,68.68 28.96,68.68 31.88,71.6 BLUE.2
N$20  (via drill 1.02)
  other vias: 28.7,59.4
N$21  (via drill 1.02)
  other vias: 26.16,59.4
N$22  (via drill 1.02)
  other vias: 26.16,61.94
N$23  (via drill 1.02)
  other vias: 26.16,64.48
N$24  (via drill 1.02)
  other vias: 26.16,67.02
N$25  (via drill 1.02)
  other vias: 23.62,67.02
N$26  (via drill 1.02)
  other vias: 23.62,64.48
N$27  (via drill 1.02)
  other vias: 23.62,61.94
N$28  (via drill 1.02)
  other vias: 23.62,59.4
N$29  (via drill 1.02)
  other vias: 21.08,61.94
N$30  (via drill 1.02)
  other vias: 21.08,64.48
N$31  (via drill 1.02)
  other vias: 21.08,67.02
N$32  (via drill 1.02)
  other vias: 18.54,64.48
N$33  (via drill 1.02)
  other vias: 16,61.94
N$34  (via drill 1.02)
  other vias: 18.54,61.94
N$35  (via drill 1.02)
  other vias: 16,59.4
N$36  (via drill 1.02)
  other vias: 18.54,59.4
N$37  (via drill 1.02)
  other vias: 16,56.86
N$38  (via drill 1.02)
  other vias: 18.54,56.86
N$39  (via drill 1.02)
  other vias: 21.08,56.86
N$40  (via drill 1.02)
  other vias: 23.62,56.86
N$41  (via drill 1.02)
  other vias: 26.16,56.86
N$42  (via drill 1.02)
  other vias: 26.16,54.32
N$43  (via drill 1.02)
  other vias: 23.62,54.32
N$44  (via drill 1.02)
  other vias: 21.08,54.32
N$45  (via drill 1.02)
  other vias: 18.54,54.32
N$46  (via drill 1.02)
  other vias: 16,54.32
N$47  (via drill 1.02)
  other vias: 18.54,51.78
N$48  (via drill 1.02)
  other vias: 18.54,49.24
N$49  (via drill 1.02)
  other vias: 21.08,49.24
N$50  (via drill 1.02)
  other vias: 23.62,51.78
N$51  (via drill 1.02)
  other vias: 23.62,49.24
N$52  (via drill 1.02)
  other vias: 26.16,49.24
N$53  (via drill 1.02)
  other vias: 26.16,51.78
N$54  (via drill 1.02)
  other vias: 28.7,56.86
N$55  (via drill 1.02)
  other vias: 28.7,54.32
N$56  (via drill 1.02)
  other vias: 28.7,51.78
N$57  (via drill 1.02)
  other vias: 28.7,49.24
N$58  (via drill 1.02)
  other vias: 21.08,51.78
N$59  (via drill 1.02)
  other vias: 21.08,59.4
N$60  (via drill 1.02)
  other vias: 13.46,59.4
N$61  (via drill 1.02)
  other vias: 31.24,56.86
N$62  (via drill 1.02)
  other vias: 31.24,54.32
N$63  (via drill 1.02)
  other vias: 31.24,51.78
N$64  (via drill 1.02)
  other vias: 31.24,49.24
PWRON  (via drill 0.38)
  Top 0.203: J1.PWRON 6.1,58.13 6.6,58.64 11.94,58.64 14.22,56.36 14.22,53.69 17.27,50.64 17.27,43.02 31.24,29.05 31.24,27.4 30.23,26.38 26.8,26.38 25.78,25.37 25.78,23.08 33.91,14.95 v40.13,14.95
  Bottom 0.203: SW.11 42.04,8.49 42.04,9.49 42.42,9.87 42.42,12.16 42.05,12.53 SW.2 42.05,14.05 41.15,14.95 v40.13,14.95
SCK  (via drill 0.38)
  Top 0.203: J1.TWI1-SCK 4.57,56.86 12.45,56.86 13.46,55.85 13.46,53.31 16.76,50.01 16.76,42.26 24.64,34.39 25.02,34.39 25.78,33.62 25.78,32.1 v30.23,27.65 29.59,27.02 26.32,27.02 25.15,25.85 25.15,20.16 28.32,16.99 28.32,10 27.17,8.85 TRANS(>^_^)>.15
  Bottom 0.203: R23.1 v30.23,27.65
SDA  (via drill 0.38)
  Top 0.203: J1.TWI1-SDA 4.57,59.4 6.86,59.4 7.87,60.42 v11.3,60.42 | v16,49.75 16,41.37 v24.38,32.99 22.73,31.34 22.73,17.75 21.46,16.48 21.46,12.29 21.21,12.03 20.57,12.03 20.31,11.77 TRANS(>^_^)>.12
  Bottom 0.203: R22.1 26.29,33.12 24.51,33.12 v24.38,32.99 | v16,49.75 15.37,50.39 15.37,51.53 14.61,52.29 14.1,52.29 13.46,52.93 13.46,57.12 11.68,58.9 11.68,59.79 11.3,60.17 v11.3,60.42
TWI2-SCK
  Bottom 0.203: J1.TWI2-SCK 40.13,39.08 37.97,39.08 36.7,37.81 U14.TWI2-SCK
TWI2-SDA
  Top 0.203: J1.TWI2-SDA 37.72,38.96 35.56,38.96 34.42,37.81 U14.TWI2-SDA
UART1-RX
  Top 0.203: J1.UART1-RX 37.72,64.36 35.18,64.36 34.04,63.21 U14.UART1-RX
UART1-TX
  Top 0.203: J1.UART1-TX 37.72,66.9 35.18,66.9 34.04,65.75 U14.UART1-TX
VCC3V3  (via drill 0.38)
  Top 0.203: J1.VCC3V3@1 37.59,59.4 34.92,59.4 33.78,58.26 U14.VCC-3V3 33.15,58.13 32.51,57.5 32.51,46.45 v32,45.94 32,34.51 30.61,33.12 v30.61,32.99 30.61,35.66 v29.84,36.42
  Bottom 0.203: J1.VCC3V3 3.3,63.09 4.57,61.82 4.57,52.55 5.33,51.78 7.05,51.78 R19.2 8.25,50.58 8.25,51.4 8.64,51.78 14.35,51.78 14.86,51.28 14.86,48.23 15.62,47.47 23.37,47.47 24.51,46.32 24.51,45.58 D3.2 30.55,44.48 v32,45.94 | D1.2 25.8,29.31 28.19,29.31 R22.2 29.08,30.32 29.97,30.32 30.23,30.58 R23.2 30.48,31.46 30.48,32.86 v30.61,32.99 | D2.2 29.4,36.86 v29.84,36.42
VCC5V  (via drill 0.38)
  Top 0.203: v24.13,25.37 23.74,24.98 TRANS(>^_^)>.9 | 3.3,65.88 J1.VCC5V@0 3.56,65.75 4.83,67.02 7.75,67.02 8.51,67.79 8.51,74.9 9.65,76.04 17.02,76.04 17.91,76.93 38.86,76.93 42.04,73.76 42.04,68.93 J1.VCC5V@1
  Top 0.406: J1.VCC5V@1 40.13,67.02 40.13,24.35 39.62,23.84 27.3,23.84 v26.8,23.34
  Bottom 0.203: R21.2 R20.2 18.41,22.7 | D5.2 30.1,22.85 | 25.27,22.85 D4.2 | U14.VCC-5V 37.59,69.56 39.88,69.56 41.15,68.29 J1.VCC5V@1
  Bottom 0.406: 30.1,22.85 30.1,23.84 29.59,24.35 27.81,24.35 v26.8,23.34 26.25,22.79 D4.2 | 18.41,22.7 18.41,23.84 19.94,25.37 v24.13,25.37 25.27,24.23 25.27,22.85
XIO-P0
  Bottom 0.203: J1.XIO-P0 38.1,53.05 36.83,51.78 35.05,51.78 U14.XIO-P0
XIO-P1
  Bottom 0.203: J1.XIO-P1 40.13,54.32 37.59,54.32 U14.XIO-P1
XIO-P2
  Top 0.203: J1.XIO-P2 37.59,51.78 35.31,51.78 34.04,50.51 U14.XIO-P2
XIO-P3
  Bottom 0.203: J1.XIO-P3 40.26,51.66 37.85,51.66 36.7,50.51 U14.XIO-P3
XIO-P4
  Top 0.203: J1.XIO-P4 37.59,49.24 35.05,49.24 U14.XIO-P4
XIO-P5
  Bottom 0.203: J1.XIO-P5 40.26,49.12 37.34,49.12 36.32,48.1 U14.XIO-P5
XIO-P6
  Top 0.203: J1.XIO-P6 37.72,46.58 35.18,46.58 34.04,45.43 U14.XIO-P6
XIO-P7
  Bottom 0.203: J1.XIO-P7 40.26,46.58 37.59,46.58 36.45,45.43 U14.XIO-P7

### Text on the board
tPlace: GND | 5V | TX | HPL | RX | HPC | FEL | HPR | 3V3 | MICM | ADC | MICN | P0 | P1 | P2 | P3 | P4 | P5 | P6 | P7 | GND | GND | ./laserz/video_graphics_array.sh | IN1 | IN3 | SDA | SCK | PCK | ICK | HS | VS | ID0 | ID1 | ID2 | ID3 | ID4 | ID5 | ID6 | ID7 | GND | GND | Next Thing Co.
bPlace: REV 1.0 | BLUE | GREEN | RED | B | G | R